# EAGLE design lipo_fuel_gauge-v11 (EAGLE 9.3.0)
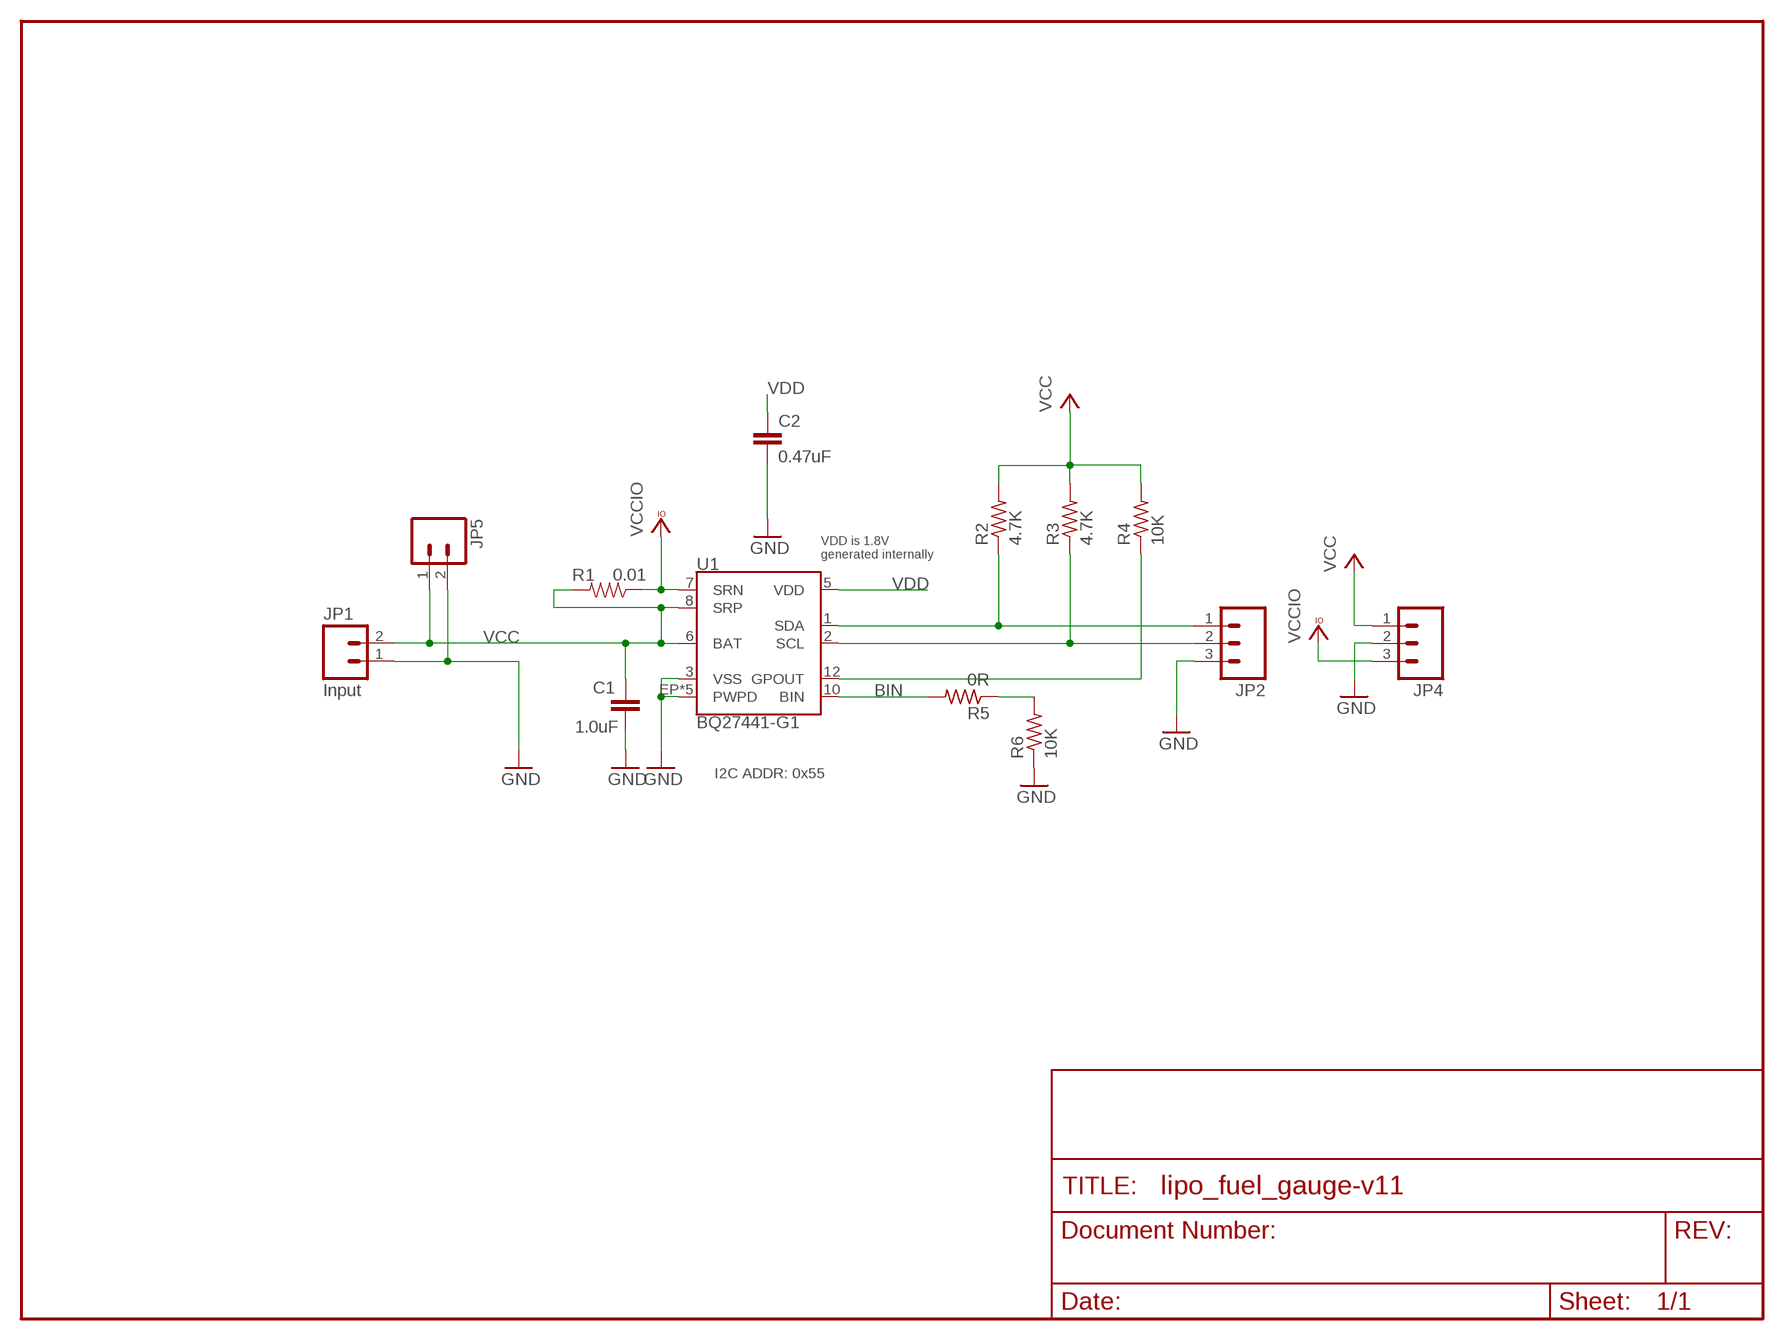
[diagram p0: schematic, sheet 1]

## Parts
C1  1.0uF  C-EUC0805  [C0805]
C2  0.47uF  C-EUC0805  [C0805]
JP1  Input  M02-JST-2MM-SMT  [JST-2-SMD]
JP2  M03PTH  [1X03]
JP4  M03PTH  [1X03]
JP5  M02PTH  [1X02]
R1  0.01  RESISTOR1206  [1206]
R2  4.7K  R-US_R0805  [R0805]
R3  4.7K  R-US_R0805  [R0805]
R4  10K  R-US_R0805  [R0805]
R5  0R  R-US_R0805  [R0805]
R6  10K  R-US_R0805  [R0805]
U1  BQ27441-G1  [PDSO-N12]

## Nets
BIN: R5.2 U1.10(BIN)
GND: C1.2 C2.2 JP1.1 JP2.3 JP4.2 JP5.2 R6.1 U1.3(VSS) U1.EP1(PWPD) U1.EP2(PWPD) U1.EP3(PWPD) U1.EP4(PWPD) U1.EP(PWPD)
GPOUT: R4.1 U1.12(GPOUT)
N$1: R5.1 R6.2
SCL: JP2.2 R3.1 U1.2(SCL)
SDA: JP2.1 R2.1 U1.1(SDA)
VCC: C1.1 JP1.2 JP4.1 JP5.1 R1.2 R2.2 R3.2 R4.2 U1.6(BAT) U1.8(SRP)
VCCIO: JP4.3 R1.1 U1.7(SRN)
VDD: C2.1 U1.5(VDD)

## Notes on the sheet
- VDD is 1.8V
  generated internally
- I2C ADDR: 0x55

## Library data of the parts
C1 C2 = rcl:C-EU: CAPACITOR, European symbol; SPICEPREFIX: C
JP1 JP5 = SparkFun:M02: Header 2 Standard 2-pin 0.1" header. Use with straight break away headers (SKU : PRT-00116), right angle break away headers (PRT-00553), swiss pins (PRT-00743), machine pins (PRT-00117), and female headers (PRT-00115). Molex polarized connector foot print use with SKU : PRT-08233 with associated crimp pins and housings.
JP2 JP4 = SparkFun:M03: Header 3 Standard 3-pin 0.1" header. Use with straight break away headers (SKU : PRT-00116), right angle break away headers (PRT-00553), swiss pins (PRT-00743), machine pins (PRT-00117), and female headers (PRT-00115). Molex polarized connector foot print use with SKU : PRT-08232 with associated crimp pins and housings.
R1 = SparkFun-Resistors:RESISTOR: Resistor Basic schematic elements and footprints for 0603, 1206, and PTH resistors.; PROD_ID: RES-13218
R2-R6 = rcl:R-US_: RESISTOR, American symbol; SPICEPREFIX: R
U1 = battery-management-temp:BQ27441-G1; PROD_ID: IC-13220

## Board
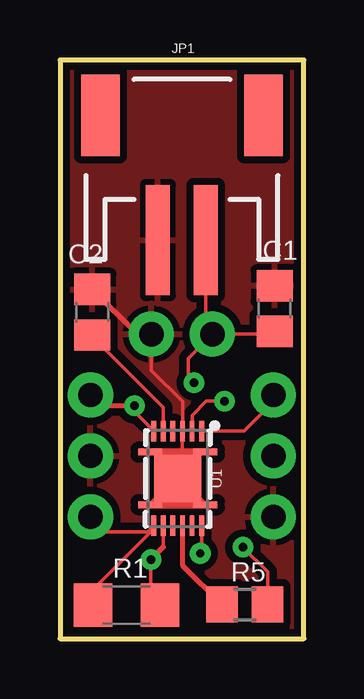
[diagram p1: board, top side]
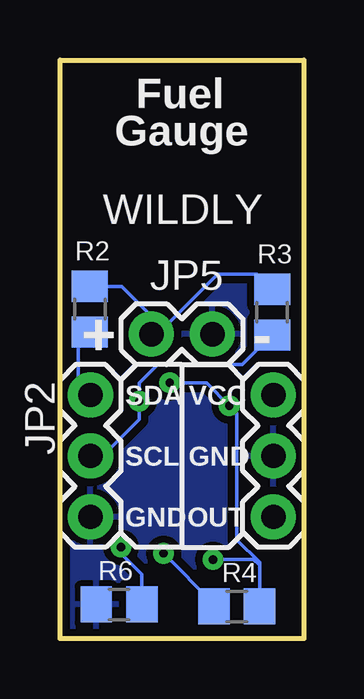
[diagram p2: board, bottom side, seen from below]

Size 10.16 x 24.13 mm. Coordinates in mm from the lower left corner, seen from the top.
Outline: 0,24.13 0,0 10.16,0 10.16,24.13 0,24.13
Copper layers (1*16): Top 0.035mm / dielectric 1.5mm / Bottom 0.035mm
Design rules "SparkFun": minimum track width 8mil, minimum drill 20mil, track to track 8mil, track to pad 8mil, pad to pad 8mil, via to via 8mil, smd to smd 8mil, copper to edge 8mil, drill to drill 8mil, minimum pad ring 12mil, minimum via ring 10mil, stop-mask expansion 4mil, vias tented up to drill 20mil, thermal gap 10mil

### Footprints (pad centres in the part's own frame; a part is rotated, then mirrored left to right if it is on the bottom)
C0805 = smd 1.3 x 1.5: 1 -0.95,0; 2 0.95,0
JST-2-SMD = smd 1 x 4.6: 1 -1,-3.7; 2 1,-3.7 | smd 1.6 x 3.4: NC1 -3.4,1.5; NC2 3.4,1.5
1X03 = drill 1.016 pad 1.88: 1 0,0; 2 2.54,0; 3 5.08,0
1X02 = drill 1.016 pad 1.88: 1 0,0; 2 2.54,0
1206 = smd 1.6 x 1.8: 1 -1.4,0; 2 1.4,0
R0805 = smd 1.3 x 1.5: 1 -0.95,0; 2 0.95,0
PDSO-N12 = smd 0.2 x 0.85: 1 -1,-1.975; 2 -0.6,-1.975; 3 -0.2,-1.975; 4 0.2,-1.975; 5 0.6,-1.975; 6 1,-1.975; 7 1,1.975; 8 0.6,1.975; 9 0.2,1.975; 10 -0.2,1.975; 11 -0.6,1.975; 12 -1,1.975 | smd 1.95 x 1.95: EP 0,0 | smd 1 x 0.25: EP1 -1.15,1.1; EP2 -1.15,-1.1; EP3 1.15,-1.1; EP4 1.15,1.1

### Placement (x,y rotation side)
C1  8.94,13.77 90 top
C2  1.35,13.61 90 top
JP1  5.08,20.32 0 top
JP2  8.89,10.16 270 bottom
JP4  1.27,10.16 270 bottom
JP5  6.35,12.7 0 bottom
R1  2.77,1.4 0 top
R2  8.92,13.74 90 bottom
R3  1.32,13.61 90 bottom
R4  2.79,1.35 0 bottom
R5  7.7,1.42 180 top
R6  7.7,1.42 0 bottom
U1  4.9,6.68 180 top

### Tracks (layer width: path | path; a pad name or v marks a point on that pad's centre or on a via)
BIN
  Top 0.203: U1.10 5.1,3.07 R5.2
GND
  Top 0.152: U1.3 5.11,9.88 3.81,11.18 JP5.2 | 5.1,7.89 5.21,7.78 U1.EP2 | U1.3 5.1,7.89 | 5.1,7.89 4.99,7.78 U1.EP3
  Top 0.203: U1.3 | U1.EP1 4.95,6.68 U1.EP 4.85,6.68 U1.EP4 | C2.2 3.21,12.7 JP5.2
  pour Bottom (isolate 0.305): 10.16,24.13 0,24.13 0,0 10.16,0
  pour Top (isolate 0.305): 10.16,24.13 0,24.13 0,0 10.16,0
GPOUT  (via drill 0.35)
  Top 0.152: U1.12 5.9,3.62 v5.84,3.56
  Bottom 0.152: v5.84,3.56 3.74,1.46 R4.1
N$1  (via drill 0.35)
  Top 0.152: R5.1 8.65,2.78 v7.62,3.81
  Bottom 0.152: v7.62,3.81 7.62,3.56 6.75,2.68 R6.2
SCL  (via drill 0.35)
  Top 0.152: U1.2 5.5,9.31 6.1,9.91 v6.86,9.91
  Bottom 0.152: R3.1 2.56,11.43 6.1,11.43 6.86,10.67 v6.86,9.91 6.86,9.14 8.38,7.62 JP2.2
SDA
  Top 0.152: U1.1 7.68,8.65 8.89,9.87 JP2.1
  Bottom 0.152: JP2.1 9.4,10.67 9.4,12.31 R2.1
VCC  (via drill 0.35)
  Top 0.152: JP1.2 6.08,12.97 JP5.1 | C1.1 8.82,12.7 JP5.1 | JP5.1 5.33,11.68 5.33,10.92 v5.59,10.67 | v3.79,3.3 3.79,1.78 R1.2 | U1.6 3.11,9.45 v3.11,9.71 | U1.8 4.3,3.82
  Top 0.203: 4.3,3.82 v3.79,3.3 | v3.11,9.71 1.72,9.71 JP4.1
  Bottom 0.152: R3.2 1.96,15.2 3.6,15.2 6.1,12.7 JP5.1 6.35,13.46 7.58,14.69 R2.2 | 5.57,10.65 4.05,10.65 v3.11,9.71 2.79,9.4 2.79,4.13 1.84,3.18 1.84,3.05 | 1.84,3.05 R4.2 | 1.84,3.05 2.1,3.3 v3.79,3.3
  Bottom 0.203: v5.59,10.67 5.57,10.65
VCCIO
  Top 0.152: 3.9,4.57 1.37,2.04 R1.1 | U1.7 3.65,4.45 1.9,4.45 JP4.3
  Top 0.203: U1.7 3.9,4.57
VDD
  Top 0.152: U1.5 4.3,9.64 1.35,12.6 C2.1

### Text on the board
bPlace: Fuel | Gauge | WILDLY | - | + | VCC | SDA | GND | SCL | OUT | GND